# EAGLE design u-nex_MOTOR_SHIELD (EAGLE 6.5.0)
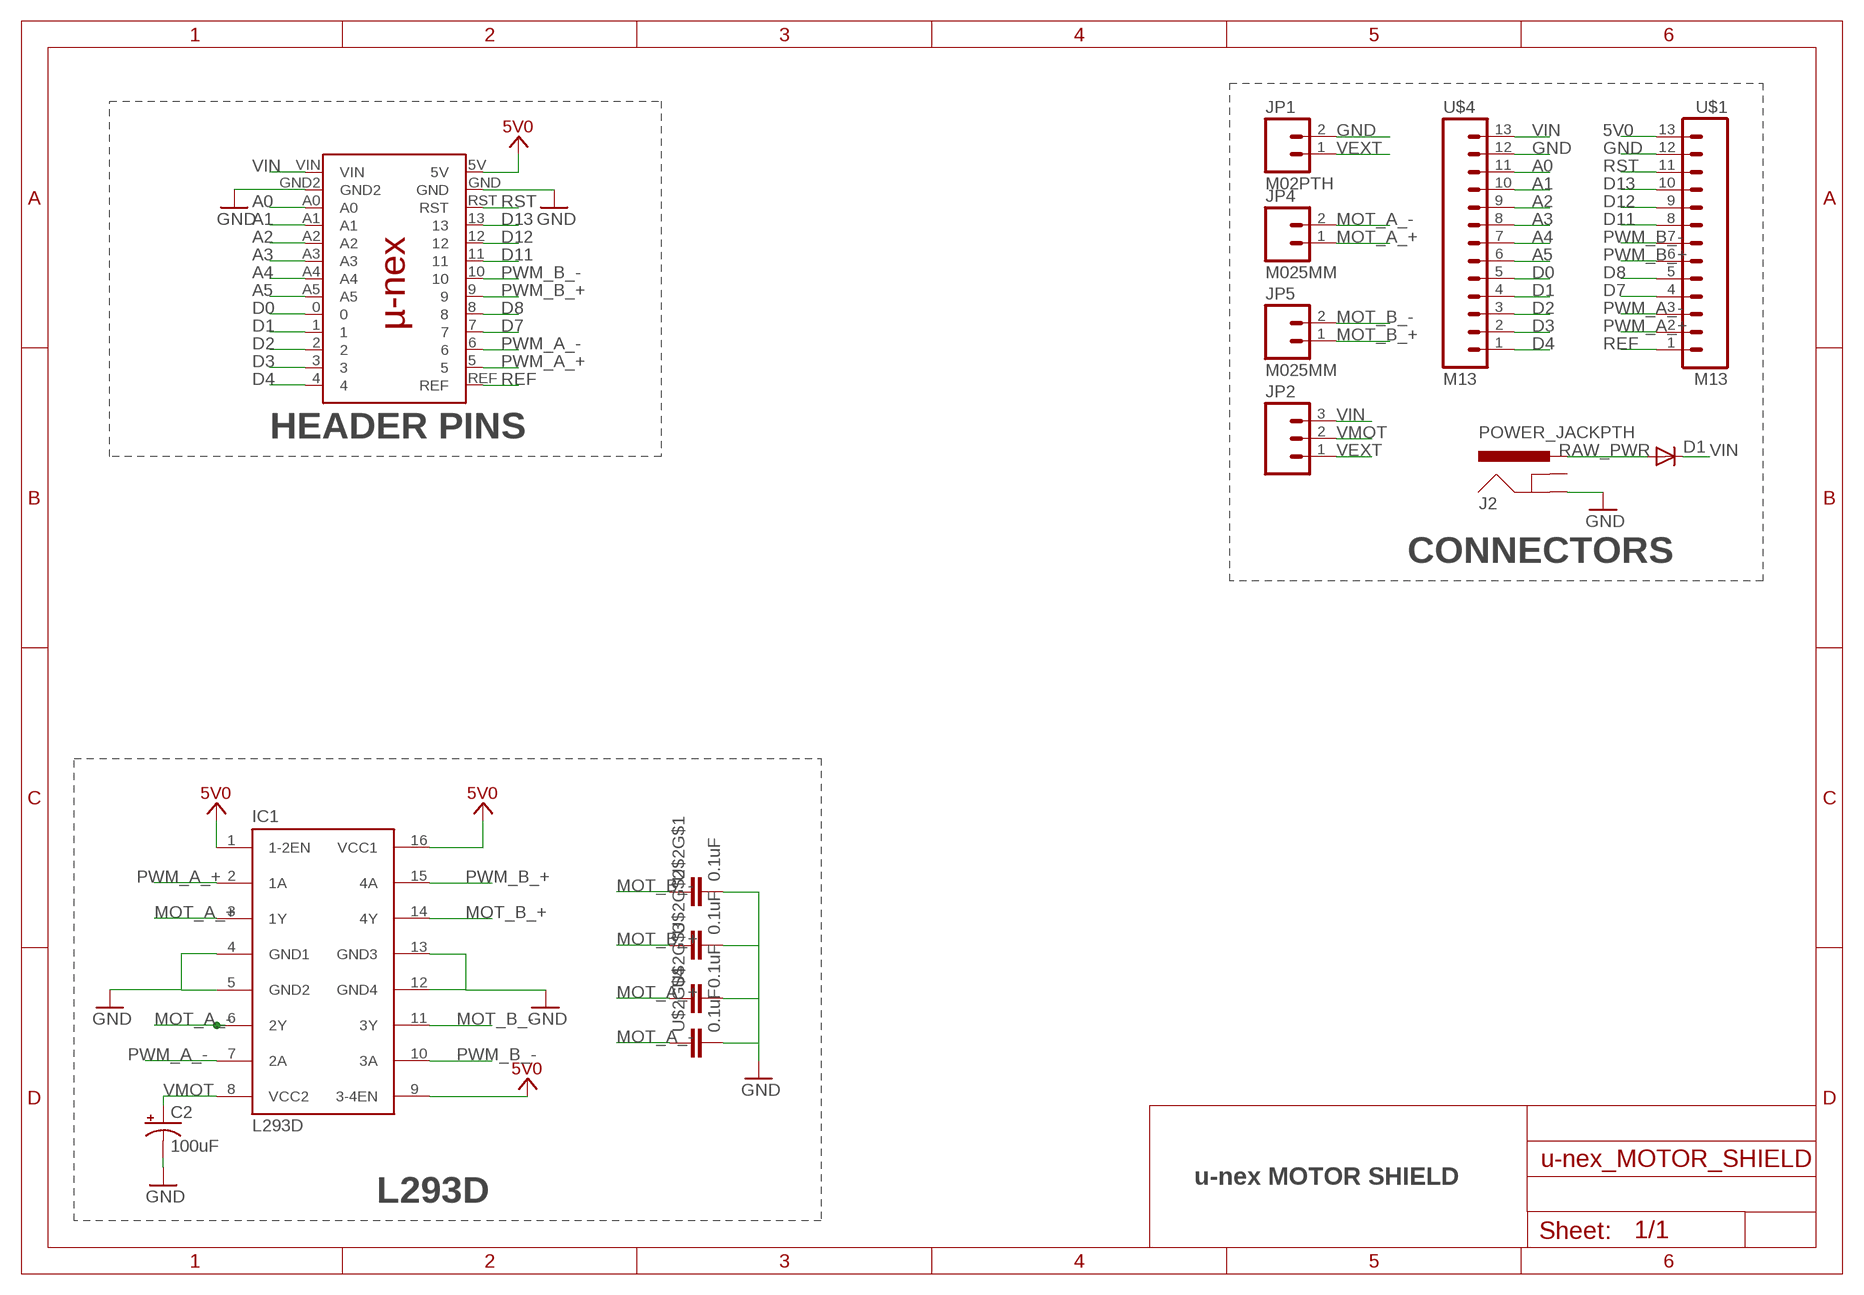
[diagram p0: schematic, sheet 1]

## Parts
C2  100uF  CAP_POLPTH1  [CPOL-RADIAL-100UF-25V]
D1  DIODEPTH  [DIODE-1N4001]
IC1  L293D  [DIL16]
J2  POWER_JACKPTH  [POWER_JACK_PTH]
JP1  M02PTH  [1X02]
JP2  M03PTH  [1X03]
JP4  M025MM  [SCREWTERMINAL-5MM-2]
JP5  M025MM  [SCREWTERMINAL-5MM-2]
U$1  M13  [1X13]
U$2  0.1uF  CAP_ARRAY_0603  [0603_ARV]
U$4  M13  [1X13]
U$10  U-NEX  [U-NEX]

## Nets
5V0: IC1.1(1-2EN) IC1.9(3-4EN) IC1.16(VCC1) U$1.13 U$10.5V
A0: U$4.11 U$10.A0
A1: U$4.10 U$10.A1
A2: U$4.9 U$10.A2
A3: U$4.8 U$10.A3
A4: U$4.7 U$10.A4
A5: U$4.6 U$10.A5
D0: U$4.5 U$10.0
D1: U$4.4 U$10.1
D2: U$4.3 U$10.2
D3: U$4.2 U$10.3
D4: U$4.1 U$10.4
D7: U$1.4 U$10.7
D8: U$1.5 U$10.8
D11: U$1.8 U$10.11
D12: U$1.9 U$10.12
D13: U$1.10 U$10.13
GND: C2.2(-) IC1.4(GND1) IC1.5(GND2) IC1.12(GND4) IC1.13(GND3) J2.GND JP1.2 U$1.12 U$2.5 U$2.6 U$2.7 U$2.8 U$4.12 U$10.GND U$10.GND2
MOT_A_+: IC1.3(1Y) JP4.1 U$2.3
MOT_A_-: IC1.6(2Y) JP4.2 U$2.4
MOT_B_+: IC1.14(4Y) JP5.1 U$2.2
MOT_B_-: IC1.11(3Y) JP5.2 U$2.1
PWM_A_+: IC1.2(1A) U$1.2 U$10.5
PWM_A_-: IC1.7(2A) U$1.3 U$10.6
PWM_B_+: IC1.15(4A) U$1.6 U$10.9
PWM_B_-: IC1.10(3A) U$1.7 U$10.10
RAW_PWR: D1.A J2.PWR
REF: U$1.1 U$10.REF
RST: U$1.11 U$10.RST
VEXT: JP1.1 JP2.1
VIN: D1.C JP2.3 U$4.13 U$10.VIN
VMOT: C2.1(+) IC1.8(VCC2) JP2.2
Unconnected: J2.GNDBREAK

## Notes on the sheet
- HEADER PINS
- CONNECTORS
- u-nex MOTOR SHIELD
- L293D

## Library data of the parts
C2 = SparkFun-Capacitors:CAP_POL: Capacitor Polarized These are standard SMD and PTH capacitors. Normally 10uF, 47uF, and 100uF in electrolytic and tantalum varieties. Always verify the external diameter of the through hole cap, it varies with capacity, voltage, and manufacturer. The EIA devices should be standard.
D1 = SparkFun-DiscreteSemi:DIODE: Diode These are standard reverse protection diodes and small signal diodes. SMA package can handle up to about 1A. SOD-323 can handle about 200mA. What the SOD-323 package when ordering, there are some mfgs out there that are 5-pin packages.
IC1 = st-microelectronics:L293D: PUSH-PULL 4 CHANNEL DRIVER; MPN: L293D; OC_FARNELL: 9589619; OC_NEWARK: 56P8249
J2 = SparkFun-Connectors:POWER_JACK: Power Jack This is the standard 5.5mm barrel jack for power. The PTH is the most common, proven, reliable, footprint. The Slot footprint only works if the mill layer is transmitted to the PCB fab house so be warned. Spark Fun Electronics SKU : PRT-00119 SMT: CONN-08106 Mating wall wart : TOL-00298 (and others)
JP1 JP4 JP5 = SparkFun-Connectors:M02: Standard 2-pin 0.1" header. Use with - straight break away headers ( PRT-00116) - right angle break away headers (PRT-00553) - swiss pins (PRT-00743) - machine pins (PRT-00117) - female headers (PRT-00115) Molex polarized connector foot print use with: PRT-08233 with associated crimp pins and housings. 2.54_SCREWTERM for use with PRT-10571. 3.5mm Screw Terminal footprints for PRT-08084 5mm Screw Terminal footprints for use with PRT-08433
JP2 = SparkFun-Connectors:M03: Header 3 Standard 3-pin 0.1" header. Use with straight break away headers (SKU : PRT-00116), right angle break away headers (PRT-00553), swiss pins (PRT-00743), machine pins (PRT-00117), and female headers (PRT-00115). Molex polarized connector foot print use with SKU : PRT-08232 with associated crimp pins and housings.
U$1 U$4 = Frenoy_custom_GOA:M13
U$2 = Frenoy_Custom:CAP_ARRAY_0603
U$10 = Frenoy_Custom:U-NEX

## Net classes
1 power: width 0.254 mm, drill 0.61 mm, clearance 0.254 mm
2 gnd: width 0.254 mm, drill 0.61 mm, clearance 0.254 mm
3 usbvcc: width 0.254 mm, drill 0.61 mm, clearance 0.254 mm
4 aref: width 0.254 mm, drill 0.61 mm, clearance 0.254 mm

## Board
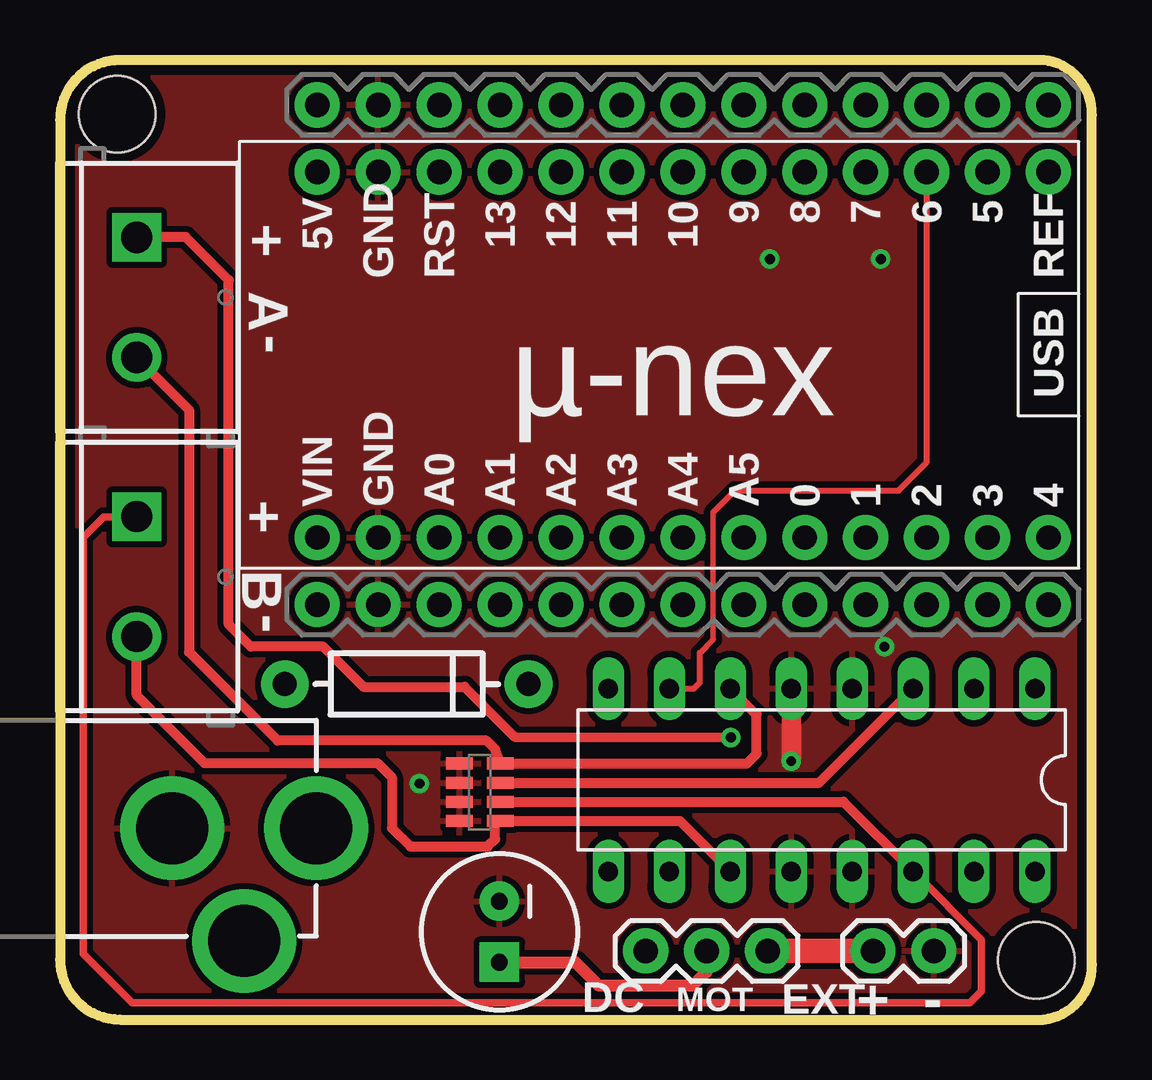
[diagram p1: board, top side]
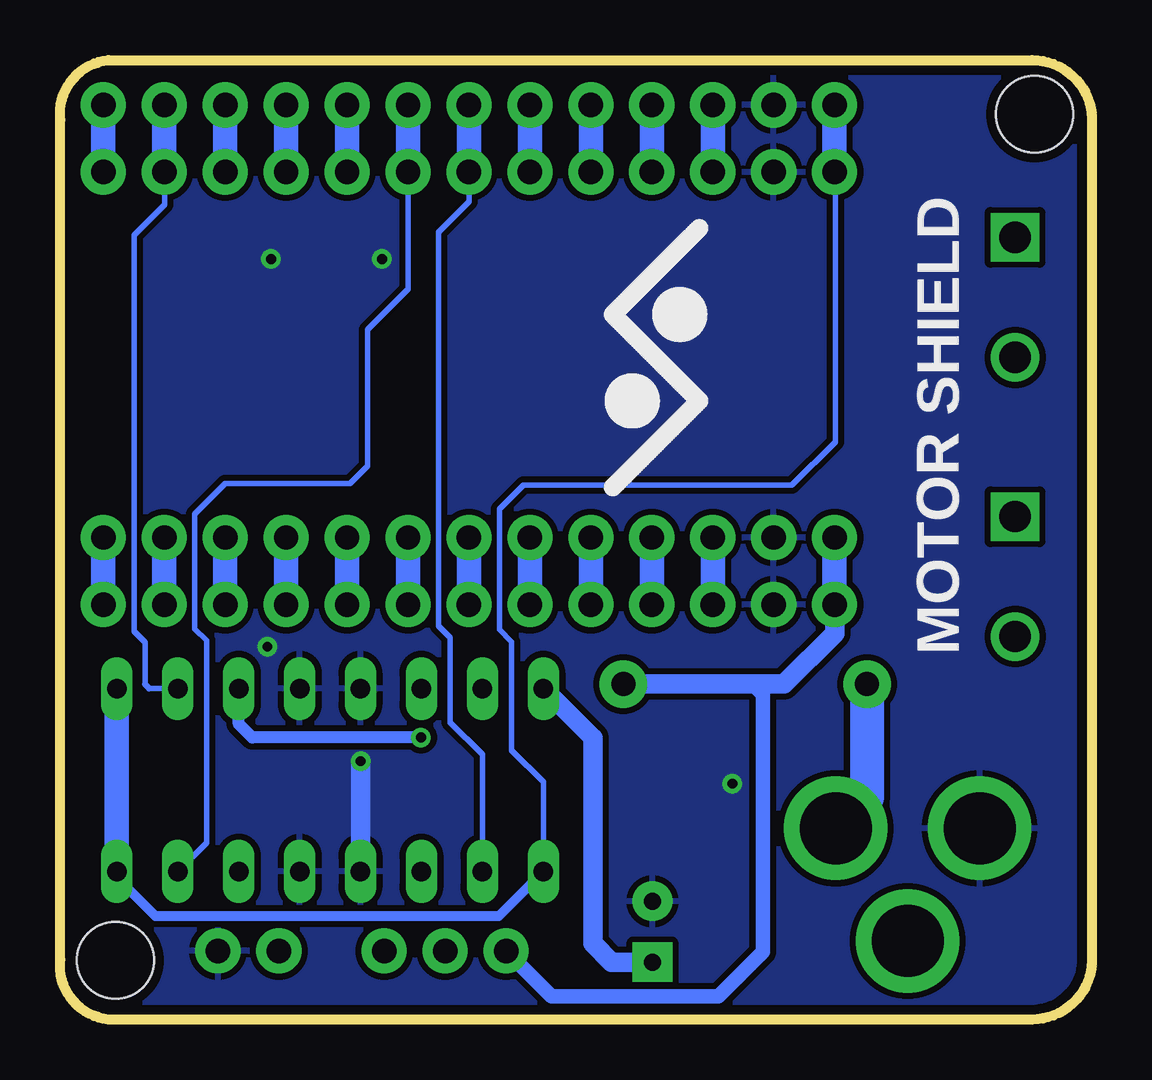
[diagram p2: board, bottom side, seen from below]

Size 43.01 x 40 mm. Coordinates in mm from the lower left corner, seen from the top.
Outline: 41,40 2.5,40 arc90 0,37.5 0,2.5 arc90 2.5,0 41,0 arc90 43,2.5 43,37.5 arc90 41,40
Copper layers (1*16): Top 0.035mm / dielectric 1.5mm / Bottom 0.035mm
Design rules "default": minimum track width 9.5mil, minimum drill 16mil, track to track 8mil, track to pad 8mil, pad to pad 8mil, via to via 8mil, smd to smd 8mil, copper to edge 16mil, drill to drill 8mil, minimum pad ring 10mil, minimum via ring 8mil, stop-mask expansion 8mil, vias tented up to drill 20mil, thermal gap 10mil
Holes 3.2 mm at 2.39,37.74 40.7,2.46

### Footprints (pad centres in the part's own frame; a part is rotated, then mirrored left to right if it is on the bottom)
CPOL-RADIAL-100UF-25V = drill 0.7 pad 1.651 square: 1 1.27,0 | drill 0.7 pad 1.651: 2 -1.27,0
DIODE-1N4001 = drill 1 pad 1.981: A -5.08,0; C 5.08,0
DIL16 = drill 0.813 long: 1 -8.89,-3.81; 2 -6.35,-3.81; 3 -3.81,-3.81; 4 -1.27,-3.81; 5 1.27,-3.81; 6 3.81,-3.81; 7 6.35,-3.81; 8 8.89,-3.81; 9 8.89,3.81; 10 6.35,3.81; 11 3.81,3.81; 12 1.27,3.81; 13 -1.27,3.81; 14 -3.81,3.81; 15 -6.35,3.81; 16 -8.89,3.81
POWER_JACK_PTH = drill 2.997 pad 4.318: GND 0,7.7; GNDBREAK 4.7,10.7; PWR 0,13.7
1X02 = drill 1.016 pad 1.88: 1 0,0; 2 2.54,0
1X03 = drill 1.016 pad 1.88: 1 0,0; 2 2.54,0; 3 5.08,0
SCREWTERMINAL-5MM-2 = drill 1.3 pad 2.032 square: 1 0,0 | drill 1.3 pad 2.032: 2 5,0
1X13 = drill 1.016 pad 1.88: 1 0,0; 2 2.54,0; 3 5.08,0; 4 7.62,0; 5 10.16,0; 6 12.7,0; 7 15.24,0; 8 17.78,0; 9 20.32,0; 10 22.86,0; 11 25.4,0; 12 27.94,0; 13 30.48,0
0603_ARV = smd 0.5 x 1.1: 1 -1.2,-0.85; 2 -0.4,-0.85; 3 0.4,-0.85; 4 1.2,-0.85; 5 1.2,0.85; 6 0.4,0.85; 7 -0.4,0.85; 8 -1.2,0.85
U-NEX = drill 1.016 pad 1.88: 0 1.27,11.43; 1 1.27,8.89; 2 1.27,6.35; 3 1.27,3.81; 4 1.27,1.27; 5 16.51,3.81; 5V 16.51,31.75; 6 16.51,6.35; 7 16.51,8.89; 8 16.51,11.43; 9 16.51,13.97; 10 16.51,16.51; 11 16.51,19.05; 12 16.51,21.59; 13 16.51,24.13; A0 1.27,26.67; A1 1.27,24.13; A2 1.27,21.59; A3 1.27,19.05; A4 1.27,16.51; A5 1.27,13.97; GND 16.51,29.21; GND2 1.27,29.21; REF 16.51,1.27; RST 16.51,26.67; VIN 1.27,31.75

### Placement (x,y rotation side)
C2  18.32,3.66 270 top
D1  14.45,13.98 0 top
IC1  31.75,9.98 180 top
J2  -3.02,7.97 270 top
JP1  33.89,2.86 0 top
JP2  29.5,2.86 180 top
JP4  3.2,32.6 270 top
JP5  3.2,20.96 270 top
U$1  41.2,38.13 180 top
U$2  17.5,9.47 90 top
U$4  41.2,17.3 180 top
U$10  42.47,18.82 90 top

### Tracks (layer width: path | path; a pad name or v marks a point on that pad's centre or on a via)
5V0
  Bottom 0.229: IC1.9 22.86,9.91 24.18,11.23 24.18,15.75 24.69,16.26 24.69,21.29 23.7,22.28 12.5,22.28 10.69,24.08 10.69,35.94
  Bottom 0.254: 10.69,35.94 10.72,35.97
  Bottom 0.406: IC1.16 40.64,5.92 39.04,4.32 24.72,4.32 IC1.9
  Bottom 1.016: U$1.13 10.72,35.97 U$10.5V | IC1.16 IC1.1
A0
  Bottom 1.016: U$4.11 U$10.A0
A1
  Bottom 1.016: U$4.10 U$10.A1
A2
  Bottom 1.016: U$4.9 U$10.A2
A3
  Bottom 1.016: U$4.8 U$10.A3
A4
  Bottom 1.016: U$4.7 U$10.A4
A5
  Bottom 1.016: U$4.6 U$10.A5
D0
  Bottom 1.016: U$4.5 U$10.0
D1
  Bottom 1.016: U$4.4 U$10.1
D2
  Bottom 1.016: U$4.3 U$10.2
D3
  Bottom 1.016: U$4.2 U$10.3
D4
  Bottom 1.016: U$4.1 U$10.4
D7
  Bottom 1.016: U$10.7 U$1.4
D8
  Bottom 1.016: U$10.8 U$1.5
D11
  Bottom 1.016: U$10.11 U$1.8
D12
  Bottom 1.016: U$10.12 U$1.9
D13
  Bottom 1.016: U$10.13 U$1.10
GND  (via drill 0.41)
  Top 0.813: IC1.5 v30.48,10.77
  Bottom 0.813: v30.48,10.77 IC1.12
  other vias: 14.99,9.83 29.59,31.7 34.21,31.7 34.37,15.54
  pour Top (isolate 0.254): -0.08,41.49 43.12,41.46 43.2,-0.66 0,-0.64
  pour Bottom (isolate 0.254): 0.08,41.49 43.99,41.49 43.91,-0.64 0,-0.64
MOT_A_+  (via drill 0.41 pad 0.71)
  Top 0.406: U$2.3 31.64,9.87 IC1.3 | v27.96,11.76 18.95,11.79 16.87,13.87 12.65,13.87 10.97,15.54 7.95,15.54 7.04,16.46 7.04,30.83 5.24,32.62 3.22,32.62 JP4.1
  Bottom 0.508: v27.96,11.76 35,11.76 35.56,12.32 IC1.3
MOT_A_-
  Top 0.406: IC1.6 29.03,12.71 29.03,11.07 28.63,10.67 U$2.4 18.13,11.29 17.78,11.63 9.07,11.63 5.38,15.32 5.38,25.42 JP4.2
MOT_B_+
  Top 0.305: IC1.14 38.41,3.33 38.41,1.18 37.92,0.69 3.02,0.69 0.96,2.74 0.96,20.09 1.83,20.95 JP5.1
  Top 0.406: U$2.2 32.66,9.07 IC1.14 35.59,6.15
MOT_B_-
  Top 0.406: IC1.11 25.84,8.27 U$2.1 18.14,8.26 18.14,7.52 17.83,7.21 14.61,7.21 13.84,7.98 13.84,10.08 13.23,10.69 6.02,10.69 3.2,13.51 JP5.2
PWM_A_+
  Bottom 0.229: IC1.2 39.3,13.79 | 39.47,13.97 39.47,15.72 39.93,16.18 39.93,32.69 38.66,33.96 U$10.5
  Bottom 0.254: 39.3,13.79 39.47,13.97 | U$10.5
  Bottom 1.016: U$10.5 U$1.2
PWM_A_-
  Top 0.229: 27.23,15.85 27.23,21.13
  Top 0.254: IC1.7 26.42,13.79 26.67,14.05 26.67,15.29 27.23,15.85 | 27.23,21.13 28.14,22.05 34.95,22.05 36.12,23.22 U$10.6
  Bottom 1.016: U$10.6 U$1.3
PWM_B_+
  Bottom 0.229: IC1.15 36.91,7.37 36.91,15.8 37.39,16.28 37.39,21.08 36.12,22.35 30.91,22.35 30.2,23.06 30.2,28.75 28.5,30.45 U$10.9
  Bottom 0.254: U$10.9
  Bottom 1.016: U$10.9 U$1.6
PWM_B_-
  Bottom 0.229: IC1.10 25.4,11.05 26.75,12.39 26.75,15.93 27.23,16.41 27.23,32.82 25.96,34.09 U$10.10
  Bottom 0.254: U$10.10
  Bottom 1.016: U$10.10 U$1.7
RAW_PWR
  Bottom 1.422: D1.A 9.37,9.28 J2.PWR
REF
  Bottom 1.016: U$10.REF U$1.1
RST
  Bottom 1.016: U$10.RST U$1.11
VEXT
  Top 1.016: JP1.1 JP2.1
VIN
  Bottom 0.61: 14.15,13.98 13.72,13.55 13.72,2.82 15.57,0.96 22.53,0.96 22.53,0.97 JP2.3
  Bottom 0.813: D1.C 14.15,13.98 12.84,13.98 10.72,16.1 U$4.13
  Bottom 1.016: U$4.13 U$10.VIN
VMOT
  Top 0.508: C2.1 21.48,2.39 22.45,1.42 26.39,1.42 26.95,1.98 JP2.2
  Bottom 0.813: C2.1 20.02,2.39 20.8,3.17 20.8,11.73 IC1.8

### Text on the board
tPlace: DC | MOT | EXT
bPlace: MOTOR SHIELD
tNames: + | A | - | + | B | - | + | -